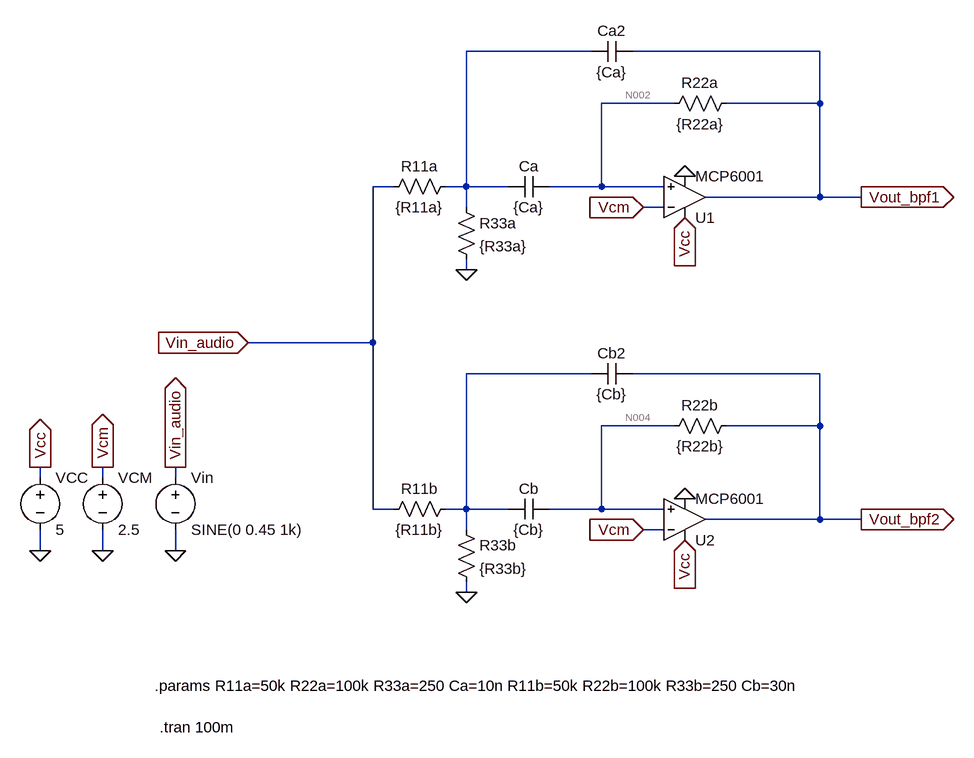
[diagram p0: schematic Exp6.asc]
* Exp6.asc
* U1: MCP6001 (symbol Ext_models\MCP6001 not available, pins judged from their places): In+=N002 In-=Vcm V+=Vcc V-=0 OUT=Vout_bpf1
Ca N002 N001 {Ca}
Ca2 Vout_bpf1 N001 {Ca}
R11a N001 Vin_audio {R11a}
R22a Vout_bpf1 N002 {R22a}
R33a N001 0 {R33a}
* U2: MCP6001 (symbol Ext_models\MCP6001 not available, pins judged from their places): In+=N004 In-=Vcm V+=Vcc V-=0 OUT=Vout_bpf2
Cb N004 N003 {Cb}
Cb2 Vout_bpf2 N003 {Cb}
R11b N003 Vin_audio {R11b}
R22b Vout_bpf2 N004 {R22b}
R33b N003 0 {R33b}
VCC Vcc 0 5
VCM Vcm 0 2.5
Vin Vin_audio 0 SINE(0 0.45 1k)
.params R11a=50k R22a=100k R33a=250 Ca=10n R11b=50k R22b=100k R33b=250 Cb=30n
.tran 100m
.backanno
.end

* Results of the author's LTspice run, read from the files saved beside the schematic
* Operating Point, zero values left out:
*   V(n002) = 2.501 V
*   V(vout_bpf1) = 2.501 V
*   V(n004) = 2.501 V
*   V(vcm) = 2.5 V
*   V(vcc) = 5 V
*   V(vout_bpf2) = 2.501 V
*   I(VCC) = -291.3 µA
*   Ix(u2:3) = 145.6 µA
*   Ix(u2:4) = -145.6 µA
*   Ix(u1:3) = 145.6 µA
*   Ix(u1:4) = -145.6 µA
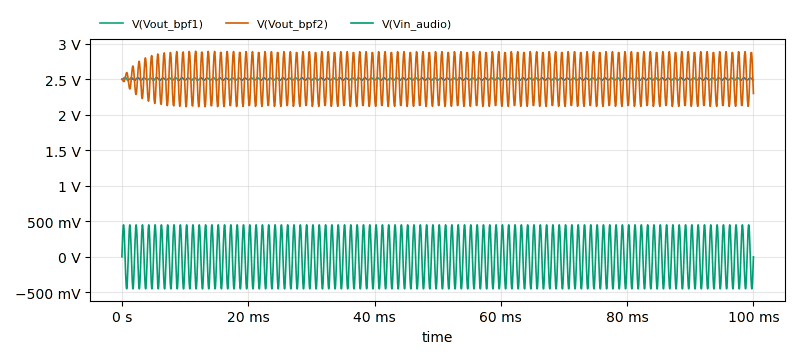
[diagram p1: Transient Analysis of Exp6.asc, plotted from the saved traces]
* Transient Analysis, 1 run:
*   V(Vout_bpf1): min 2.479 V, max 2.522 V, average 2.501 V, rms 2.501 V, last 2.485 V
*   V(Vout_bpf2): min 2.111 V, max 2.891 V, average 2.501 V, rms 2.516 V, last 2.297 V
*   V(Vin_audio): min -450 mV, max 450 mV, average 5.09 µV, rms 322.4 mV, last 0 V